# Altium schematic sheet NIXIE_3.SchDoc
size A4; PageSetup: Record=PageOptions|CenterHorizontal=True|CenterVertical=True|PrintScale=0.34|XCorrection=1.00|YCorrection=1.00|PrintKind=0|BorderSize=5000000|LeftOffset=0|BottomOffset=0|Orientation=2|PaperLength=1000|PaperWidth=1000|Scale=100|PaperSource=7|PrintQuality=-3|MediaType=1|DitherType=10|PrintScaleMode=1|PaperKind=A4|PaperIndex=9
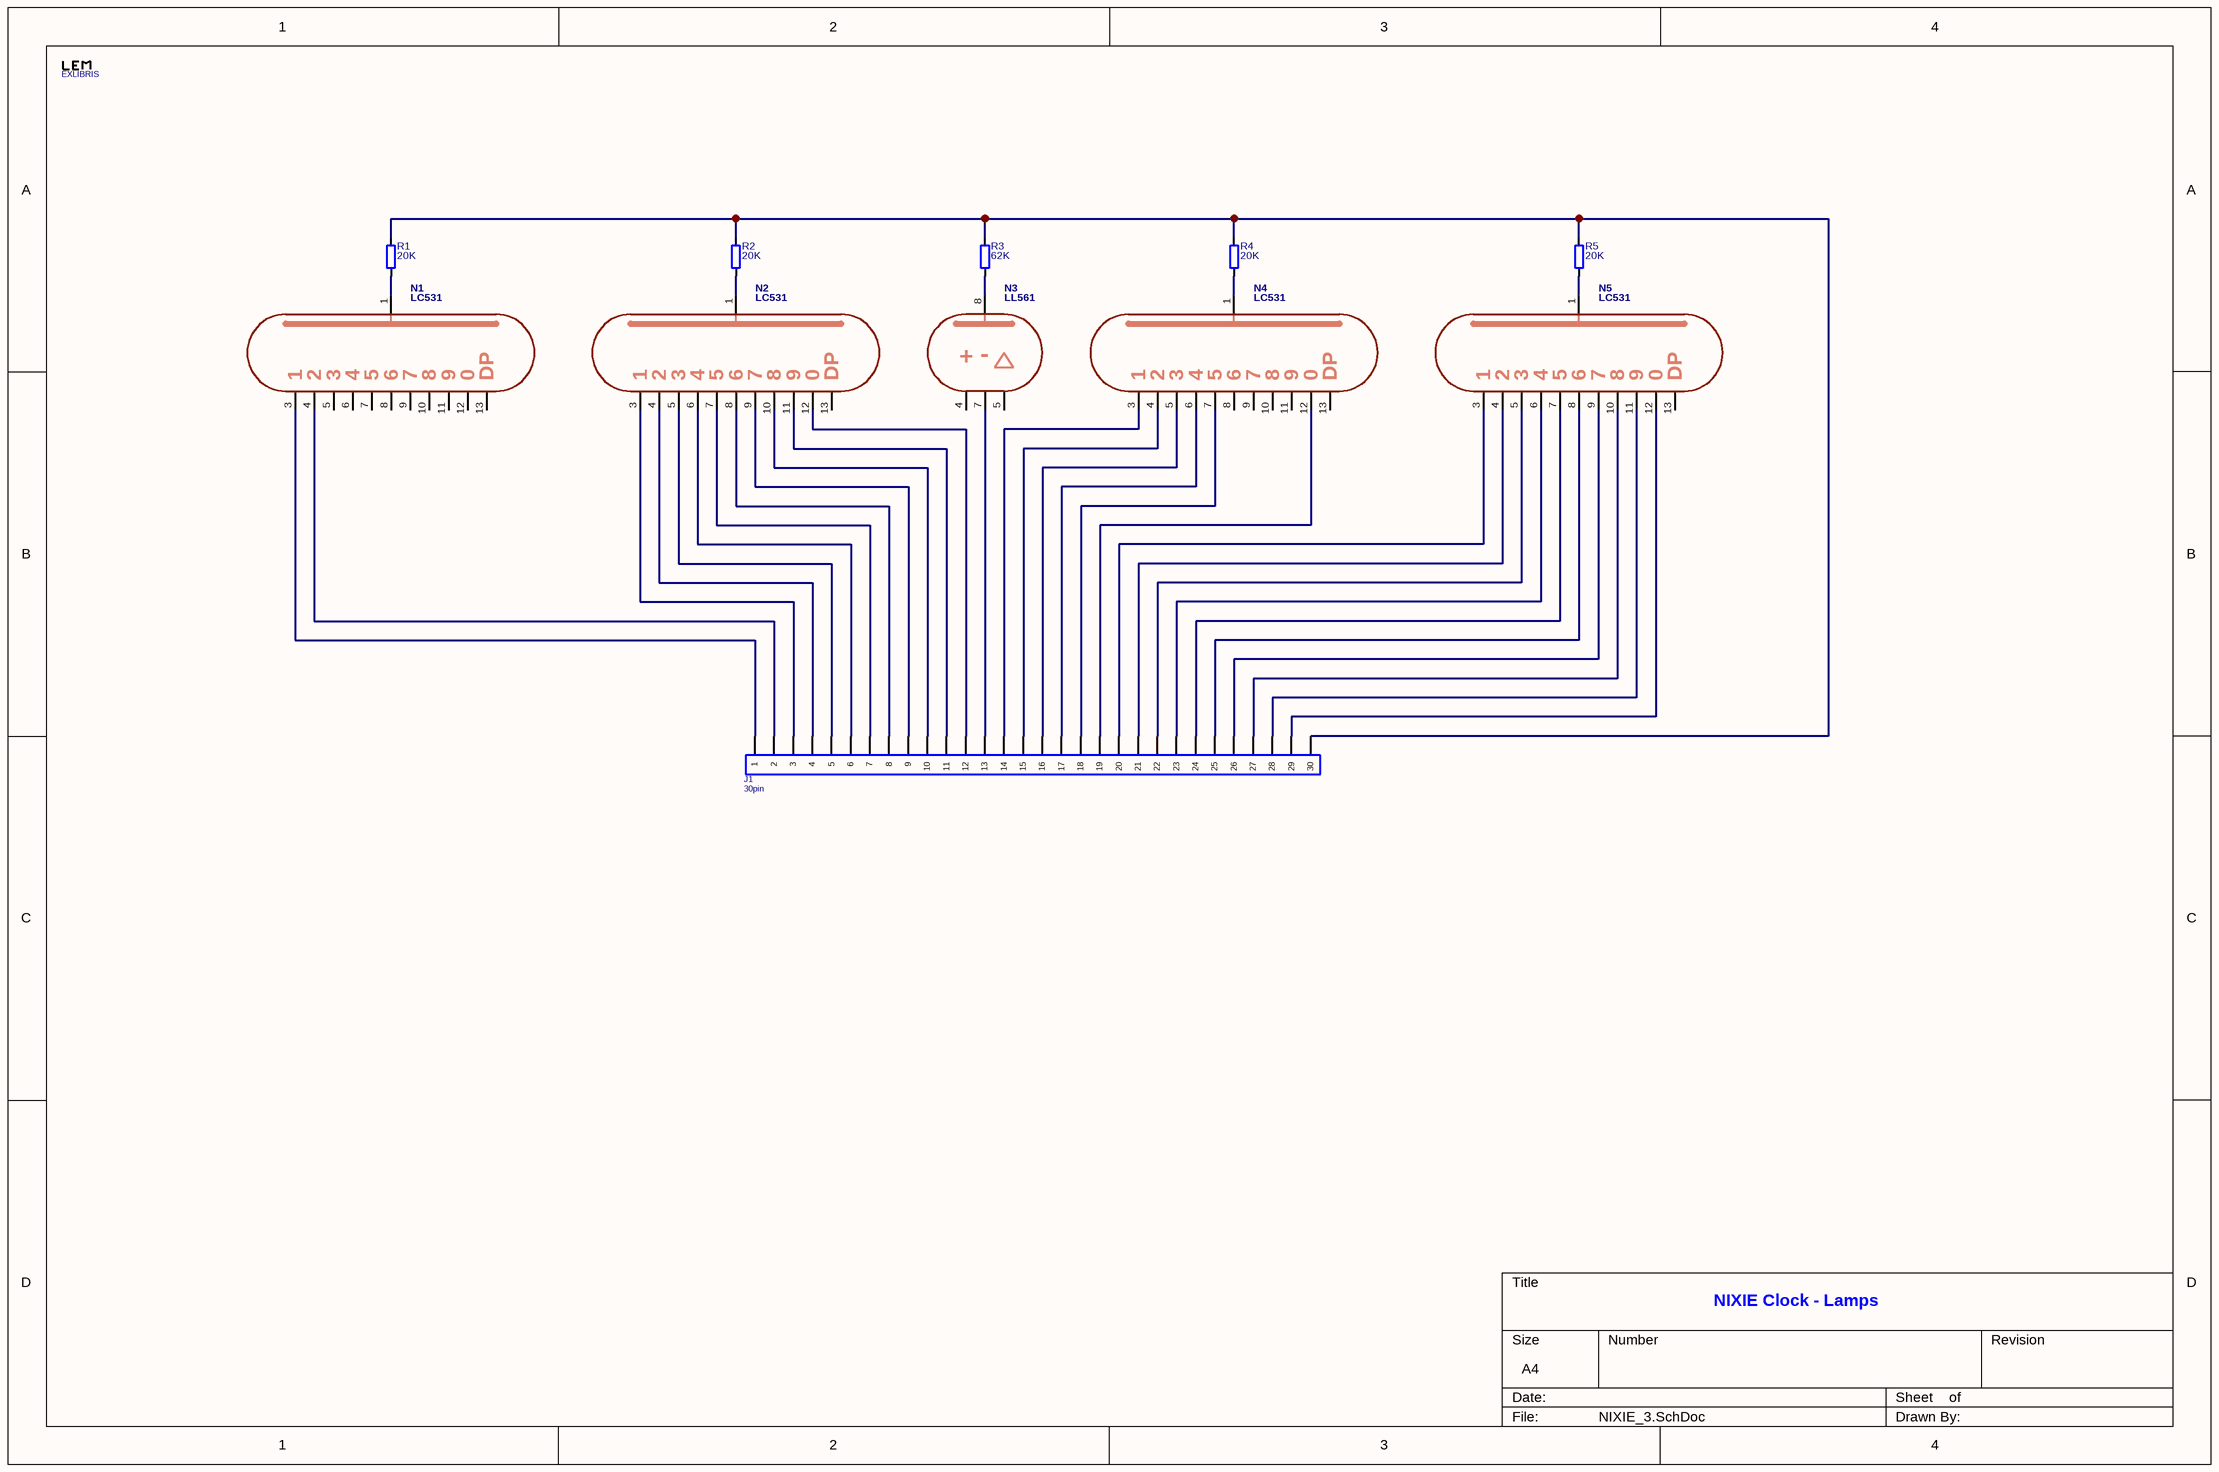
[diagram p0: NIXIE_3.SchDoc]

## Parts
EXLIBRIS  EXLIBRIS  [EXLBS_2]
J1  30pin  [SIL30]
N1  LC531  [Nixie LC531]
N2  LC531  [Nixie LC531]
N3  LL561  [NIXIE LL561]
N4  LC531  [Nixie LC531]
N5  LC531  [Nixie LC531]
R1  20K  [SMD_R_0805]
R2  20K  [SMD_R_0805]
R3  62K  [SMD_R_0805]
R4  20K  [SMD_R_0805]
R5  20K  [SMD_R_0805]

## Nets
NetJ1_1: J1.1 N1.3(1)
NetJ1_2: J1.2 N1.4(2)
NetJ1_3: J1.3 N2.3(1)
NetJ1_4: J1.4 N2.4(2)
NetJ1_5: J1.5 N2.5(3)
NetJ1_6: J1.6 N2.6(4)
NetJ1_7: J1.7 N2.7(5)
NetJ1_8: J1.8 N2.8(6)
NetJ1_9: J1.9 N2.9(7)
NetJ1_10: J1.10 N2.10(8)
NetJ1_11: J1.11 N2.11(9)
NetJ1_12: J1.12 N2.12(0)
NetJ1_13: J1.13 N3.7(-)
NetJ1_14: J1.14 N4.3(1)
NetJ1_15: J1.15 N4.4(2)
NetJ1_16: J1.16 N4.5(3)
NetJ1_17: J1.17 N4.6(4)
NetJ1_18: J1.18 N4.7(5)
NetJ1_19: J1.19 N4.12(0)
NetJ1_20: J1.20 N5.3(1)
NetJ1_21: J1.21 N5.4(2)
NetJ1_22: J1.22 N5.5(3)
NetJ1_23: J1.23 N5.6(4)
NetJ1_24: J1.24 N5.7(5)
NetJ1_25: J1.25 N5.8(6)
NetJ1_26: J1.26 N5.9(7)
NetJ1_27: J1.27 N5.10(8)
NetJ1_28: J1.28 N5.11(9)
NetJ1_29: J1.29 N5.12(0)
NetJ1_30: J1.30 R1.2 R2.2 R3.2 R4.2 R5.2
NetN1_1: N1.1(A) R1.1
NetN2_1: N2.1(A) R2.1
NetN3_8: N3.8(A) R3.1
NetN4_1: N4.1(A) R4.1
NetN5_1: N5.1(A) R5.1

Not connected (* = marked no-connect by the designer): N1 5(3) 6(4) 7(5) 8(6) 9(7) 10(8) 11(9) 12(0) 13(DP); N2 13(DP); N3 4(+) 5(DELTA); N4 8(6) 9(7) 10(8) 11(9) 13(DP); N5 13(DP)

## Notes on the sheet
- NIXIE Clock - Lamps

## Library data of the parts
EXLIBRIS = EXLBR
J1 = CON 30pin
N1 N2 N4 N5 = NIXIE LC531: Lampa Numeryczna Nixie
N3 = NIXIE LL561: SIGN NEON LAMP
R1-R5 = R: Resistor